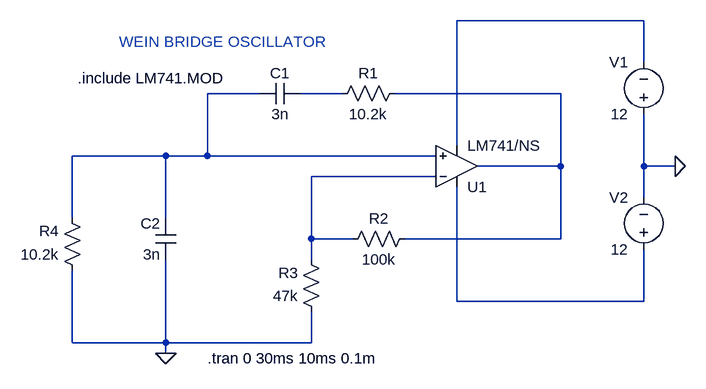
[diagram p0: schematic Wein Bridge Oscillator.asc]
Wein Bridge Oscillator.asc, the LTspice schematic file:
Version 4
SHEET 1 1004 680
WIRE 768 -128 480 -128
WIRE 768 -64 768 -128
WIRE 176 -16 96 -16
WIRE 304 -16 240 -16
WIRE 640 -16 384 -16
WIRE 480 64 480 -128
WIRE 32 80 -112 80
WIRE 96 80 96 -16
WIRE 96 80 32 80
WIRE 448 80 96 80
WIRE 640 96 640 -16
WIRE 640 96 512 96
WIRE 768 96 768 16
WIRE 816 96 768 96
WIRE 448 112 256 112
WIRE 768 144 768 96
WIRE -112 176 -112 80
WIRE 32 176 32 80
WIRE 256 208 256 112
WIRE 320 208 256 208
WIRE 640 208 640 96
WIRE 640 208 400 208
WIRE 256 240 256 208
WIRE 480 304 480 128
WIRE 768 304 768 224
WIRE 768 304 480 304
WIRE -112 368 -112 256
WIRE 32 368 32 240
WIRE 32 368 -112 368
WIRE 256 368 256 320
WIRE 256 368 32 368
WIRE 32 384 32 368
FLAG 816 96 0
FLAG 32 384 0
SYMBOL res 400 -32 R90
WINDOW 0 0 56 VBottom 2
WINDOW 3 32 56 VTop 2
SYMATTR InstName R1
SYMATTR Value 10.2k
SYMBOL cap 240 -32 R90
WINDOW 0 0 32 VBottom 2
WINDOW 3 32 32 VTop 2
SYMATTR InstName C1
SYMATTR Value 3n
SYMBOL cap 48 240 R180
WINDOW 0 24 56 Left 2
WINDOW 3 24 8 Left 2
SYMATTR InstName C2
SYMATTR Value 3n
SYMBOL res 416 192 R90
WINDOW 0 0 56 VBottom 2
WINDOW 3 32 56 VTop 2
SYMATTR InstName R2
SYMATTR Value 100k
SYMBOL res 272 336 R180
WINDOW 0 36 76 Left 2
WINDOW 3 36 40 Left 2
SYMATTR InstName R3
SYMATTR Value 47k
SYMBOL res -96 272 R180
WINDOW 0 36 76 Left 2
WINDOW 3 36 40 Left 2
SYMATTR InstName R4
SYMATTR Value 10.2k
SYMBOL OpAmps\\opamp2 480 160 M180
SYMATTR InstName U1
SYMATTR Value LM741/NS
SYMBOL voltage 768 32 R180
WINDOW 0 24 96 Left 2
WINDOW 3 24 16 Left 2
SYMATTR InstName V1
SYMATTR Value 12
SYMBOL voltage 768 240 R180
WINDOW 0 24 96 Left 2
WINDOW 3 24 16 Left 2
SYMATTR InstName V2
SYMATTR Value 12
TEXT -104 -40 Left 2 !.include LM741.MOD
TEXT 96 392 Left 2 !.tran 0 30ms 10ms 0.1m
TEXT -40 -96 Left 2 ;WEIN BRIDGE OSCILLATOR

The netlist it stands for:
* Wein Bridge Oscillator.asc
R1 N004 N003 10.2k
C1 N003 N002 3n
C2 0 N002 3n
R2 N004 N005 100k
R3 0 N005 47k
R4 0 N002 10.2k
XU1 N002 N005 N006 N001 N004 LM741/NS  ; pins In+ In- V+ V- OUT
V1 0 N001 12
V2 N006 0 12
.include LM741.MOD
.tran 0 30ms 10ms 0.1m
* WEIN BRIDGE OSCILLATOR
.backanno
.end